# Altium project CentraleProject.PrjPcb
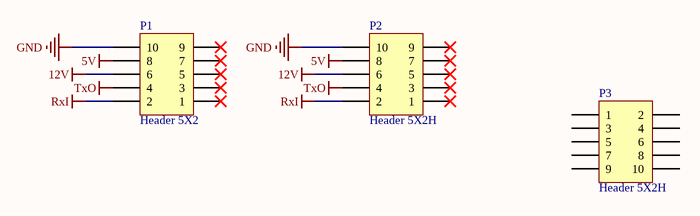
[diagram p0: SchemaCentrale.SchDoc]
1 sheet, 3 parts. Net scope: global (net labels, ports and power ports of the same name join across sheets).
Board file: PCB1.PcbDoc

## Sheet SchemaCentrale.SchDoc
size A4

### Parts
P1  Header 5X2  [Header10Coude]
P2  Header 5X2H  [HEADERDroit]
P3  Header 5X2H  [HEADERACHEVAL]

### Nets
5V: P1.8 P2.8
12V: P1.6 P2.6
GND: P1.10 P2.10
RxI: P1.2 P2.2
TxO: P1.4 P2.4

Not connected (* = marked no-connect by the designer): P1 1* 3* 5* 7* 9*; P2 1* 3* 5* 7* 9*; P3 1 2 3 4 5 6 7 8 9 10

### Library data of the parts
P1 = Header 5X2: Header, 5-Pin, Dual row; LatestRevisionDate: 17-Jul-2002; LatestRevisionNote: Re-released for DXP Platform.; Publisher: Altium Limited
P2 P3 = Header 5X2H: Header, 5-Pin, Dual row, Right Angle; LatestRevisionDate: 17-Jul-2002; LatestRevisionNote: Re-released for DXP Platform.; Publisher: Altium Limited